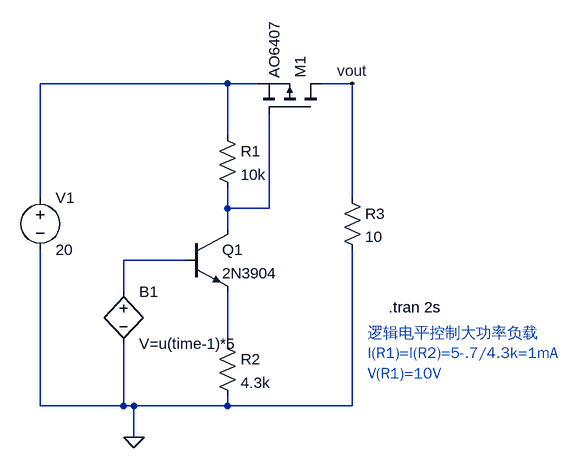
[diagram p0: schematic Draft2.asc]
Draft2.asc, the LTspice schematic file:
Version 4
SHEET 1 988 680
WIRE 464 64 176 64
WIRE 512 64 464 64
WIRE 656 64 608 64
WIRE 464 144 464 64
WIRE 176 240 176 64
WIRE 656 240 656 64
WIRE 464 256 464 224
WIRE 528 256 528 112
WIRE 528 256 464 256
WIRE 464 288 464 256
WIRE 400 336 304 336
WIRE 304 384 304 336
WIRE 464 464 464 384
WIRE 176 560 176 320
WIRE 304 560 304 464
WIRE 304 560 176 560
WIRE 320 560 304 560
WIRE 464 560 464 544
WIRE 464 560 320 560
WIRE 656 560 656 320
WIRE 656 560 464 560
WIRE 320 608 320 560
FLAG 320 608 0
FLAG 656 64 vout
SYMBOL Voltage 176 224 R0
SYMATTR InstName V1
SYMATTR Value 20
SYMBOL Res 448 128 R0
SYMATTR InstName R1
SYMATTR Value 10k
SYMBOL Res 448 448 R0
SYMATTR InstName R2
SYMATTR Value 4.3k
SYMBOL npn 400 288 R0
SYMATTR InstName Q1
SYMATTR Value 2N3904
SYMBOL pmos 608 112 M270
SYMATTR InstName M1
SYMATTR Value AO6407
SYMBOL Res 640 224 R0
SYMATTR InstName R3
SYMATTR Value 10
SYMBOL bv 304 368 R0
SYMATTR InstName B1
SYMATTR Value V=u(time-1)*5
TEXT 680 448 Left 2 ;逻辑电平控制大功率负载\nI(R1)=I(R2)=5-.7/4.3k=1mA\nV(R1)=10V
TEXT 712 408 Left 2 !.tran 2s

The netlist it stands for:
* Draft2.asc
V1 N001 0 20
R1 N001 N002 10k
R2 N004 0 4.3k
Q1 N002 N003 N004 0 2N3904
M1 vout N002 N001 N001 AO6407
R3 vout 0 10
B1 N003 0 V=u(time-1)*5
.model NPN NPN
.model PNP PNP
.lib standard.bjt
.model NMOS NMOS
.model PMOS PMOS
.lib standard.mos
* 逻辑电平控制大功率负载
* I(R1)=I(R2)=5-.7/4.3k=1mA
* V(R1)=10V
.tran 2s
.backanno
.end